# EAGLE board Maduino Zero 4G LTE A7670X v1.1 (EAGLE 6.1)
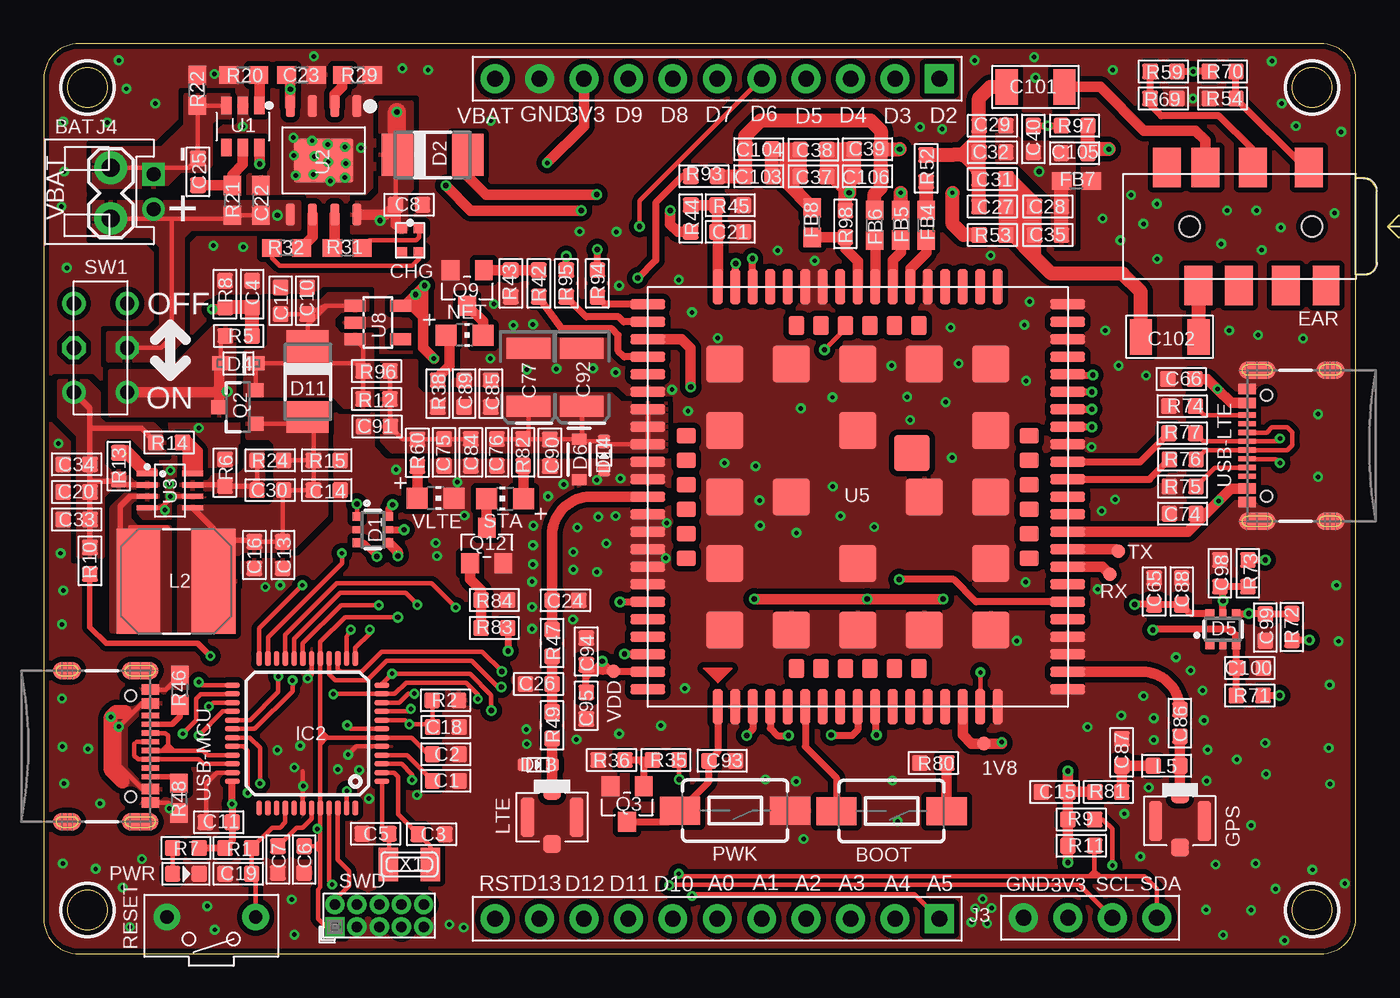
[diagram p2: board, top side]
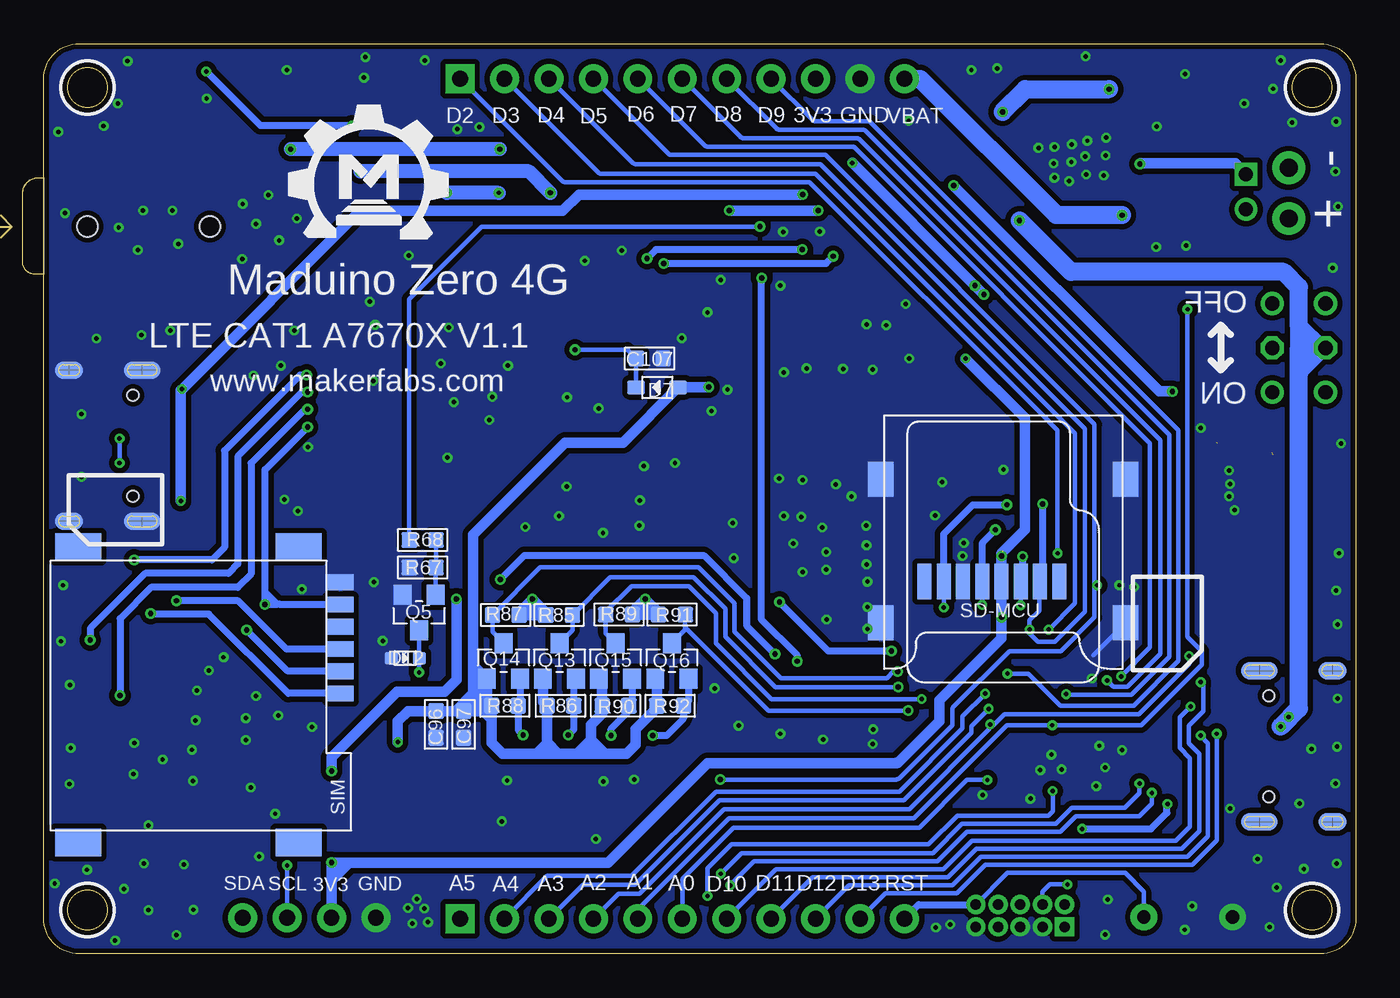
[diagram p3: board, bottom side, seen from below]

Size 75 x 52 mm. Coordinates in mm from the lower left corner, seen from the top.
Outline: 2,0 73,0 arc90 75,2 75,50 arc90 73,52 2,52 arc90 0,50 0,2 arc90 2,0
Outline: circle at 72.5,2.5 radius 1.14
Outline: circle at 72.5,49.5 radius 1.14
Outline: circle at 2.5,2.5 radius 1.14
Outline: circle at 2.5,49.5 radius 1.14
Copper layers (1*16): Top 0.035mm / dielectric 1.5mm / Bottom 0.035mm
Design rules: minimum track width 6mil, minimum drill 10mil, track to track 6mil, track to pad 6mil, pad to pad 6mil, via to via 6mil, smd to smd 0mil, copper to edge 10mil, drill to drill 10mil, minimum pad ring 10mil, minimum via ring 6mil, stop-mask expansion 2mil, vias tented up to drill 30mil, thermal gap 0mil
Net classes: 0 default: width 0.203 mm; 2 gnd: width 0.305 mm, drill 0.559 mm, clearance 0.254 mm; 3 usbvcc: width 0.508 mm, drill 0.61 mm, clearance 0.254 mm; 4 USBpair: width 0.254 mm, drill 0.406 mm, clearance 0.406 mm

## Footprints (pad centres in the part's own frame; a part is rotated, then mirrored left to right if it is on the bottom)
PH2.0-2P-90-DIP = drill 0.8 square: 1 0,1 | drill 0.8: 2 0,-1
TACTILE_SWITCH_SMD_6.0X3.5MM = smd 2.3 x 1.6: 1 -3.15,0; 2 3.15,0
0603 = smd 0.889 x 0.889: 1 -0.762,0; 2 0.762,0
0603' = smd 1.1 x 1: 1 -0.85,0; 2 0.85,0
EIA3528 = smd 1.2 x 2.5: A 1.65,0; C -1.65,0
DISCRETE_C1206 = smd 1.27 x 2.032: 1 -1.651,0; 2 1.651,0
SMD4-160L160W = smd 0.6 x 0.7: 1 -0.7,0.5; 2 0.7,0.5; 3 -0.7,-0.5; 4 0.7,-0.5
PINHEAD_2X05_127 = drill 0.6 pad 1.016 square: 1 -0.635,2.54 | drill 0.6 pad 1.016: 2 0.635,2.54; 3 -0.635,1.27; 4 0.635,1.27; 5 -0.635,0; 6 0.635,0; 7 -0.635,-1.27; 8 0.635,-1.27; 9 -0.635,-2.54; 10 0.635,-2.54
SOT363 = smd 0.5 x 0.5: 1 -0.75,-0.9; 3 0.75,-0.9; 4 0.75,0.9; 6 -0.75,0.9 | smd 0.4 x 0.5: 2 0,-0.9; 5 0,0.9
DO-214AC = smd 1.8 x 2.4: A 2.025,0; C -2.025,0
SOD-323F = smd 1 x 0.8: A -1,0; C 1,0
SOD-323 = smd 0.63 x 0.83: A 1.15,0; C -1.15,0
SOD323 = smd 1 x 0.8: + -1.2,0; - 1.2,0
DISCRETE_SOD523 = smd 0.762 x 0.7: + -0.8,0; - 0.8,0
AUDIO8P-SMD-3.5-14.5X6.1X4.0MM = smd 1.6 x 2.25: 1 3.9,-3.375; 2 7.1,-3.375; 3 9.8,-3.375; 4 10.2,3.375; 6 5.2,3.375; 7 7.9,3.375; 8 12,-3.375 | smd 1.5 x 2.25: 5 2.9,3.375 | hole 1.2: 3.7,0; 10.7,0
4P-U-FL = smd 1.016 x 1.016: D -1.524,0; GND3 1.524,0 | smd 2.286 x 0.762: GND1 0,1.397; GND2 0,-1.397
TQFP48-7X7 = smd 0.85 x 0.32: 1 -4.275,2.75; 2 -4.275,2.25; 3 -4.275,1.75; 4 -4.275,1.25; 5 -4.275,0.75; 6 -4.275,0.25; 7 -4.275,-0.25; 8 -4.275,-0.75; 9 -4.275,-1.25; 10 -4.275,-1.75; 11 -4.275,-2.25; 12 -4.275,-2.75; 25 4.275,-2.75; 26 4.275,-2.25; 27 4.275,-1.75; 28 4.275,-1.25; 29 4.275,-0.75; 30 4.275,-0.25; 31 4.275,0.25; 32 4.275,0.75; 33 4.275,1.25; 34 4.275,1.75; 35 4.275,2.25; 36 4.275,2.75 | smd 0.32 x 0.85: 13 -2.75,-4.275; 14 -2.25,-4.275; 15 -1.75,-4.275; 16 -1.25,-4.275; 17 -0.75,-4.275; 18 -0.25,-4.275; 19 0.25,-4.275; 20 0.75,-4.275; 21 1.25,-4.275; 22 1.75,-4.275; 23 2.25,-4.275; 24 2.75,-4.275; 37 2.75,4.275; 38 2.25,4.275; 39 1.75,4.275; 40 1.25,4.275; 41 0.75,4.275; 42 0.25,4.275; 43 -0.25,4.275; 44 -0.75,4.275; 45 -1.25,4.275; 46 -1.75,4.275; 47 -2.25,4.275; 48 -2.75,4.275
11P-2.54 = drill 0.889 pad 1.651 square: 1 0,12.7 | drill 0.889 pad 1.651: 2 0,10.16; 3 0,7.62; 4 0,5.08; 5 0,2.54; 6 0,0; 7 0,-2.54; 8 0,-5.08; 9 0,-7.62; 10 0,-10.16; 11 0,-12.7
4P-65/35ROUND = drill 0.889 pad 1.651: 1 0,3.81; 2 0,1.27; 3 0,-1.27; 4 0,-3.81
1X02_LOCK = drill 1.016 pad 1.88: 1 -0.178,0; 2 2.718,0
SRN6045 = smd 2.5 x 6: 1 -2.175,0; 2 2.125,0
L0603 = smd 0.889 x 0.889: 1 -0.762,0; 2 0.762,0
CHIP-LED0805 = smd 1.2 x 1.2: A 0,-1.05; C 0,1.05
LED-0603 = smd 0.889 x 0.889: + -0.762,0; - 0.762,0
SOT23-3 = smd 0.8 x 0.9: 1 -0.95,-1; 2 0.95,-1; 3 0,1.1
SOT23 = smd 1.016 x 1.143: 1 -0.95,-1.016; 2 0.95,-1.016; 3 0,1.016
R0603 = smd 0.889 x 0.889: 1 -0.762,0; 2 0.762,0
0603-NO = smd 1.1 x 1: 1 -0.85,0; 2 0.85,0
2P-7.62X3.56-90D = drill 0.762 pad 1.524: P$1 0,2.54; P$2 0,-2.54
8P-SMD = smd 0.8 x 2.008: 1 -3.198,0.254; 2 -2.098,0.254; 3 -0.998,0.254; 4 0.102,0.254; 5 1.202,0.254; 6 2.302,0.254; 7 3.402,0.254; 8 4.502,0.254 | smd 1.45 x 2: 9 -7.002,2.6; 10 7.002,2.6; 11 -7.002,-5.598; 12 7.002,-5.598
MICROSIM = smd 1.5 x 0.9: 1 -0.8,2.5; 2 -0.8,5.04; 3 -0.8,7.58; 5 -0.8,1.23; 6 -0.8,3.77; 7 -0.8,6.31 | smd 2.61 x 1.56: P$1 1.6,-0.8; P$2 14.2,-0.8; P$3 14.2,16.1; P$4 1.6,16.1
6P-2CH-2.54-7.6X3.0 = drill 0.813 pad 1.27: CH1A -1.524,2.54; CH1B -1.524,-2.54; CH2A 1.524,2.54; CH2B 1.524,-2.54 | drill 0.813 pad 1.27 octagon: COM1 -1.524,0; COM2 1.524,0
PAD.03X.03 = smd 0.762 x 0.762: P$1 0,0
SOT-23-6 = smd 1 x 0.6: 1 -1.2,0.95; 2 -1.2,0; 3 -1.2,-0.95; 4 1.2,-0.95; 5 1.2,0; 6 1.2,0.95
SOP8-1.27P = smd 1.27 x 0.51: 1 -3.1,1.905; 2 -3.1,0.635; 3 -3.1,-0.635; 4 -3.1,-1.905; 5 3.1,-1.905; 6 3.1,-0.635; 7 3.1,0.635; 8 3.1,1.905 | smd 2.5 x 3.4: 9 0,0
TSOT23-8 = smd 1.2 x 0.3: 1 -1.3,0.975; 2 -1.3,0.325; 3 -1.3,-0.325; 4 -1.3,-0.975; 5 1.3,-0.975; 6 1.3,-0.325; 7 1.3,0.325; 8 1.3,0.975
A7670G = smd 2 x 0.6: 1 -12,8; 2 -12,7; 3 -12,6; 4 -12,5; 5 -12,4; 6 -12,3; 7 -12,2; 8 -12,1; 9 -12,0; 10 -12,-1; 11 -12,-2; 12 -12,-3; 13 -12,-4; 14 -12,-5; 15 -12,-6; 16 -12,-7; 17 -12,-8; 35 12,-8; 36 12,-7; 37 12,-6; 38 12,-5; 39 12,-4; 40 12,-3; 41 12,-2; 42 12,-1; 43 12,0; 44 12,1; 45 12,2; 46 12,3; 47 12,4; 48 12,5; 49 12,6; 50 12,7; 51 12,8 | smd 0.6 x 2: 18 -8,-12; 19 -7,-12; 20 -6,-12; 21 -5,-12; 22 -4,-12; 23 -3,-12; 24 -2,-12; 25 -1,-12; 26 0,-12; 27 1,-12; 28 2,-12; 29 3,-12; 30 4,-12; 31 5,-12; 32 6,-12; 33 7,-12; 34 8,-12; 52 8,12; 53 7,12; 54 6,12; 55 5,12; 56 4,12; 57 3,12; 58 2,12; 59 1,12; 60 0,12; 61 -1,12; 62 -2,12; 63 -3,12; 64 -4,12; 65 -5,12; 66 -6,12; 67 -7,12; 68 -8,12; 89 -11,-12; 90 -10,-12; 91 -9,-12; 92 9,-12; 93 10,-12; 94 11,-12; 95 11,12; 96 10,12; 97 9,12; 98 -9,12; 99 -10,12; 100 -11,12 | smd 2.1 x 2.1: 69 -7.6,7.6; 70 -7.6,3.8; 71 -7.6,0; 72 -7.6,-3.8; 73 -7.6,-7.6; 74 -3.8,-7.6; 75 0,-7.6; 76 3.8,-7.6; 77 7.6,-7.6; 78 7.6,-3.8; 79 7.6,0; 80 7.6,3.8; 81 7.6,7.6; 82 3.8,7.6; 83 0,7.6; 84 -3.8,7.6; 85 -3.8,0; 86 0,-3.8; 87 3.8,0; 88 0,3.8 | smd 1.1 x 0.9: 101 -9.8,3.5; 102 -9.8,2.1; 103 -9.8,0.7; 104 -9.8,-0.7; 105 -9.8,-2.1; 106 -9.8,-3.5; 113 9.8,-3.5; 114 9.8,-2.1; 115 9.8,-0.7; 116 9.8,0.7; 117 9.8,2.1; 118 9.8,3.5 | smd 0.9 x 1.1: 107 -3.5,-9.8; 108 -2.1,-9.8; 109 -0.7,-9.8; 110 0.7,-9.8; 111 2.1,-9.8; 112 3.5,-9.8; 119 3.5,9.8; 120 2.1,9.8; 121 0.7,9.8; 122 -0.7,9.8; 123 -2.1,9.8; 124 -3.5,9.8 | smd 2.05 x 2.05: 125 2.5,-3.1
SOT23-5 = smd 0.69 x 1.2: 1 -0.95,-1.3; 2 0,-1.3; 3 0.95,-1.3; 4 0.95,1.3; 5 -0.95,1.3
USB-C-16P-5 = smd 0.3 x 1: A5 -1.25,-0.34; A6 -0.25,-0.34; A7 0.25,-0.34; A8 1.25,-0.34; B5 1.75,-0.34; B6 0.75,-0.34; B7 -0.75,-0.34; B8 -1.75,-0.34 | smd 0.6 x 1: GND -3.225,-0.34; GND2 3.225,-0.34; VBUS1 -2.45,-0.34; VBUS2 2.45,-0.34 | smd 1 x 2.1: SHLD1 -4.32,-0.915; SHLD2 4.32,-0.915 | smd 1 x 2.1 bottom: SHLD3 -4.32,-0.915; SHLD4 4.32,-0.915 | smd 1 x 1.6: SHLD5 -4.32,-5.095; SHLD8 4.32,-5.095 | smd 1 x 1.6 bottom: SHLD6 -4.32,-5.095; SHLD7 4.32,-5.095 | hole 0.65: -2.89,-1.445; 2.89,-1.445
XTAL3215 = smd 1.1 x 1.9: P$1 1.2,0; P$2 -1.2,0

## Placement (x,y rotation side)
BAT  PH2.0-2P-90-DIP  [PH2.0-2P-90-DIP]  6.27,43.54 0 top
BOOT  MOMENTARY-SWITCH-SPST-SMD-6.0X3.5MM  [TACTILE_SWITCH_SMD_6.0X3.5MM]  48.46,8.15 180 top
C1  1uF  [0603]  22.99,9.88 0 top
C2  100nF  [0603]  22.99,11.4 180 top
C3  22pF  [0603]  22.17,6.83 0 top
C4  0.1uF  [0603]  11.91,37.69 90 top
C5  22pF  [0603]  18.97,6.86 180 top
C6  100nF  [0603]  14.88,5.38 270 top
C7  1uF  [0603]  13.39,5.38 270 top
C8  0.1uF  [0603]  20.88,42.8 0 top
C10  4.7uF  [0603]  15.06,37.31 270 top
C11  4.7uF  [0603]  10.01,7.52 0 top
C13  10uF  [0603]  13.67,22.78 90 top
C14  1uF  [0603]  16.18,26.49 180 top
C15  100nF  [0603]  57.78,9.25 180 top
C16  1uF  [0603]  12.04,22.78 90 top
C17  10uF  [0603]  13.54,37.31 270 top
C18  0.1uF  [0603]  22.99,12.95 0 top
C19  0.1uF  [0603]  11.13,4.57 0 top
C20  10uF  [0603]  1.88,26.39 0 top
C21  1nF  [0603]  39.24,41.25 0 top
C22  10uF  [0603']  12.42,43.05 90 top
C23  1.0uF  [0603']  14.73,50.22 0 top
C24  NC  [0603]  29.82,20.19 180 top
C25  0.1uF  [0603]  8.81,44.68 270 top
C26  NC  [0603]  28.3,15.42 0 top
C27  33pF  [0603]  54.23,42.7 180 top
C28  33pF  [0603]  57.4,42.7 180 top
C29  33pF  [0603]  54.23,47.32 0 top
C30  33pF  [0603]  12.95,26.49 0 top
C31  100pF  [0603]  54.23,44.27 180 top
C32  100pF  [0603]  54.23,45.8 0 top
C33  1uF  [0603]  1.88,24.82 0 top
C34  0.1uF  [0603]  1.88,27.97 0 top
C35  100pF  [0603]  57.4,41.07 180 top
C37  33pF  [0603]  43.99,44.42 180 top
C38  100pF  [0603]  43.99,45.95 180 top
C39  10pF  [0603]  47.09,45.97 0 top
C40  10pF  [0603]  56.57,46.56 90 top
C65  33pF  [0603]  63.47,20.7 270 top
C66  10uF  [0603]  65.02,32.84 180 top
C74  0.1uF  [0603]  65.1,25.15 180 top
C75  10uF  [0603]  22.89,28.65 90 top
C76  1uF  [0603]  25.91,28.65 90 top
C77  100uF  [EIA3528]  27.71,32.94 270 top
C84  10uF  [0603]  24.41,28.65 90 top
C85  1uF  [0603]  25.55,32 270 top
C86  100pF  [0603]  64.95,13.18 90 top
C87  33pF  [0603]  61.62,11.51 90 top
C88  0.1uF  [0603]  65.05,20.7 270 top
C89  10pF  [0603]  24.03,32 270 top
C90  33pF  [0603]  28.93,28.63 90 top
C91  0.1uF  [0603]  19.05,30.12 0 top
C92  100uF  [EIA3528]  30.76,32.94 270 top
C93  NC  [0603]  38.79,11.02 180 top
C94  1uF  [0603]  31.01,17.27 270 top
C95  0.1uF  [0603]  31.01,14.17 90 top
C96  1uF  [0603]  52.58,13.11 90 bottom
C97  0.1uF  [0603]  51,13.11 90 bottom
C98  22pF_NC  [0603]  67.23,21.74 270 top
C99  22pF_NC  [0603]  69.82,18.64 90 top
C100  22pF_NC  [0603]  68.94,16.33 180 top
C101  47uF  [DISCRETE_C1206]  56.69,49.53 0 top
C102  47uF  [DISCRETE_C1206]  64.36,35.26 0 top
C103  33pF  [0603]  40.87,44.42 180 top
C104  100pF  [0603]  40.87,45.97 180 top
C105  33pF  [0603]  58.93,45.75 180 top
C106  100pF  [0603]  47.09,44.42 180 top
C107  33pF  [0603]  40.36,34.01 180 bottom
CHG  [SMD4-160L160W]  20.95,40.77 90 top
CN2  PINHEAD-2x5-P1.27  [PINHEAD_2X05_127]  19.18,2.18 90 top
D1  SMF05C  [SOT363]  18.82,24.23 270 top
D2  SS34  [DO-214AC]  22.23,45.64 0 top
D4  [SOD-323F]  11.13,33.73 0 top
D5  SMF05C  [SOT363]  67.41,18.54 0 top
D6  5.1V  [SOD-323]  30.61,28.24 270 top
D7  B5819WS  [SOD323]  39.93,32.36 180 bottom
D11  SS54  [DO-214AC]  15.09,32.69 270 top
D12  0603ESDA-05N  [DISCRETE_SOD523]  54.33,16.89 0 bottom
D13  0603ESDA-05N  [DISCRETE_SOD523]  28.27,10.79 0 top
D14  0603ESDA-05N  [DISCRETE_SOD523]  32.03,28.47 90 top
EAR  AUDIO-JACK-8P-SMD  [AUDIO8P-SMD-3.5-14.5X6.1X4.0MM]  76.2,41.55 180 top
FB4  120Ω  [0603']  50.44,41.63 90 top
FB5  120Ω  [0603']  49,41.63 270 top
FB6  120Ω  [0603']  47.5,41.63 90 top
FB7  120Ω  [0603']  59.03,44.17 0 top
FB8  120Ω  [0603']  43.92,41.78 90 top
GPS  [4P-U-FL]  64.95,7.59 270 top
IC2  SAMD21G18A-AUT  [TQFP48-7X7]  15.06,12.6 180 top
J2  [11P-2.54]  38.5,50 270 top
J3  [4P-65/35ROUND]  59.82,2.06 270 top
J4  [1X02_LOCK]  3.84,42.19 90 top
J8  [11P-2.54]  38.5,2 270 top
L2  10µH/±20%/3A  [SRN6045]  7.59,21.29 0 top
L5  68nH  [L0603]  64.19,10.74 0 top
LTE  [4P-U-FL]  29.06,7.8 270 top
NET  NET  [CHIP-LED0805]  24.05,35.36 270 top
PWK  MOMENTARY-SWITCH-SPST-SMD-6.0X3.5MM  [TACTILE_SWITCH_SMD_6.0X3.5MM]  39.52,8.18 180 top
PWR  RED  [LED-0603]  8.13,4.57 0 top
Q2  MOSFET-PCHANNEL  [SOT23-3]  11.13,31.24 90 top
Q3  2N7002  [SOT23]  33.35,8.56 180 top
Q5  2N7002  [SOT23]  53.54,19.51 180 bottom
Q9  BC847C  [SOT23]  24.21,38.05 180 top
Q12  BC847C  [SOT23]  25.32,23.32 0 top
Q13  2N7002  [SOT23]  45.52,16.74 0 bottom
Q14  2N7002  [SOT23]  48.72,16.74 0 bottom
Q15  2N7002  [SOT23]  42.32,16.74 0 bottom
Q16  2N7002  [SOT23]  39.09,16.74 0 bottom
R1  10k  [R0603]  11.13,6.05 180 top
R2  1M  [R0603]  22.96,14.48 180 top
R5  1M/1%  [R0603]  11.15,35.31 180 top
R6  33K  [R0603]  10.36,27.48 270 top
R7  1K  [R0603]  8.13,6.05 180 top
R8  1M/1%  [R0603]  10.36,37.69 270 top
R9  4.7K  [R0603]  59.31,7.67 180 top
R10  1M  [R0603]  2.64,22.45 90 top
R11  4.7K  [R0603]  59.31,6.17 180 top
R12  0R  [R0603]  19.02,31.7 180 top
R13  100K  [R0603]  4.29,27.86 270 top
R14  200K  [R0603]  7.16,29.21 180 top
R15  100k  [R0603]  16.18,28.19 0 top
R20  1K  [0603']  11.43,50.22 0 top
R21  100R  [0603']  10.79,43.05 90 top
R22  NC  [0603']  8.79,49.35 90 top
R24  200K  [R0603]  12.95,28.19 0 top
R29  1.2k  [0603']  17.93,50.22 180 top
R31  47R  [0603']  17.35,40.34 0 top
R32  47R  [0603']  13.89,40.34 180 top
R35  1K  [R0603]  35.56,11.07 0 top
R36  10K  [R0603]  32.46,11.07 0 top
R38  1.2K  [R0603]  22.53,32 270 top
R42  100R  [R0603]  28.3,38.3 270 top
R43  30K  [R0603]  26.7,38.3 90 top
R44  680K  [R0603]  36.98,42.01 270 top
R45  470K  [R0603]  39.24,42.77 180 top
R46  5.1K  [0603-NO]  7.8,15.06 90 top
R47  0R  [R0603]  29.06,17.75 270 top
R48  5.1K  [0603-NO]  7.72,8.89 270 top
R49  0R  [R0603]  29.06,13.06 270 top
R52  0R  [R0603]  50.44,44.88 270 top
R53  0R  [R0603]  54.23,41.07 180 top
R54  NC  [R0603]  67.39,48.87 180 top
R59  NC  [R0603]  64.01,50.42 180 top
R60  1K  [R0603]  21.36,28.63 90 top
R67  10K  [R0603]  53.34,22.07 0 bottom
R68  1K  [R0603]  53.34,23.65 180 bottom
R69  0R  [R0603]  64.01,48.87 0 top
R70  0R  [R0603]  67.39,50.42 0 top
R71  22R  [R0603]  68.94,14.76 180 top
R72  22R  [R0603]  71.35,18.67 90 top
R73  22R  [R0603]  68.83,21.74 270 top
R74  5.1K  [R0603]  65.07,31.29 0 top
R75  5.1K  [R0603]  65.1,26.7 0 top
R76  22R  [R0603]  65.1,28.24 0 top
R77  22R  [R0603]  65.07,29.74 0 top
R80  1K  [R0603]  50.85,10.9 180 top
R81  0R  [R0603]  60.86,9.25 180 top
R82  1.2K  [R0603]  27.41,28.65 90 top
R83  100R  [R0603]  25.76,18.62 0 top
R84  30K  [R0603]  25.76,20.22 180 top
R85  30K  [R0603]  45.54,19.35 180 bottom
R86  10K  [R0603]  45.47,14.17 180 bottom
R87  30K  [R0603]  48.59,19.35 0 bottom
R88  10K  [R0603]  48.64,14.17 180 bottom
R89  30K  [R0603]  42.11,19.38 0 bottom
R90  10K  [R0603]  42.32,14.17 180 bottom
R91  30K  [R0603]  39.09,19.38 180 bottom
R92  10K  [R0603]  39.19,14.17 180 bottom
R93  2.2K  [R0603]  37.74,44.42 0 top
R94  1K  [R0603]  31.65,38.3 90 top
R95  1K  [R0603]  29.87,38.3 90 top
R96  0R  [R0603]  19.02,33.3 180 top
R97  0R  [R0603]  58.93,47.32 0 top
R98  2.2K  [R0603]  45.82,41.71 90 top
RESET  [2P-7.62X3.56-90D]  9.58,2.11 270 top
SD-MCU  SD  [8P-SMD]  20.16,21.53 180 bottom
SIM  MICROSIM  [MICROSIM]  58.83,22.45 180 bottom
STA  NET  [CHIP-LED0805]  26.37,26.01 90 top
SW1  [6P-2CH-2.54-7.6X3.0]  3.25,34.62 180 top
TP1  TEST-POINT3  [PAD.03X.03]  32.56,16.13 0 top
TP2  TEST-POINT3  [PAD.03X.03]  61.42,22.99 0 top
TP3  TEST-POINT3  [PAD.03X.03]  60.93,21.69 0 top
TP6  TEST-POINT3  [PAD.03X.03]  53.75,12.01 0 top
U1  DW06D  [SOT-23-6]  11.38,47.27 270 top
U2  TP4056  [SOP8-1.27P]  16,45.34 270 top
U3  MP2143DJ-LF-Z  [TSOT23-8]  7.21,26.47 0 top
U5  A7670G  [A7670G]  46.53,26.11 90 top
U8  SPX3819  [SOT23-5]  19.1,36.07 270 top
U$1  [MAKERFABS_0.3]  60.54,40.89 0 bottom
USB-LTE  [USB-C-16P-5]  68.45,29.03 90 top
USB-MCU  [USB-C-16P-5]  6.43,11.86 270 top
VLTE  LED2  [CHIP-LED0805]  22.4,26.04 270 top
X1  32.768K  [XTAL3215]  20.9,5.11 0 top

## Tracks (layer width: path | path; a pad name or v marks a point on that pad's centre or on a via)
1.8V  (via drill 0.25, 0.3)
  Top 0.61: U5.97 36.47,35.11 36.98,34.59 v36.98,32.38 | U5.15 52.53,12.52 53.03,12.01 TP6.P$1 53.77,11.99 53.8,11.99 53.82,12.01 54.76,12.01 v54.76,12.09
  Bottom 0.254: 38.7,32.38 D7.+
  Bottom 0.406: 42.82,11.48 43.71,12.37 44.35,11.73 | 44.65,11.43 44.35,11.73 | 44.35,11.73 43.31,11.73 43.64,11.4 45.41,11.4 46.2,12.19 46.94,11.46 48.06,11.46
  Bottom 0.61: 43.61,11.43 41.68,11.43 41.17,11.94 41.17,12.83 39.95,14.05 R92.2 39.95,15.64 Q16.1 | 43.61,11.43 44.65,11.43 46.13,11.43 | 43.61,11.43 43.71,11.53 43.71,12.37 43.71,13.08 43.08,13.72 R90.2 43.08,15.54 Q15.1 | 46.13,11.43 46.23,11.53 R86.2 46.47,14.41 Q13.1 | R88.2 49.4,13.39 | 49.4,13.39 49.4,12.06 48.77,11.43 46.13,11.43 | 50.44,16.5 Q14.1 49.67,14.44 R88.2 | 50.44,16.5 50.44,23.95 45.19,29.21 41.88,29.21 D7.+ | 38.7,32.38 v36.98,32.38 | R88.2 49.71,13.87 C97.2 51.08,13.87 | 51.46,13.87 C96.2 54.18,13.87 54.76,13.28 v54.76,12.09 | 50.44,16.5 50.44,14.88 51.46,13.87 | 51.46,13.87 51.08,13.87 | 51.08,13.87 49.94,15.01 49.94,14.3 50.27,13.97 49.99,13.97 49.4,13.39
+3V3  (via drill 0.25, 0.3)  (1 unrouted)
  Top 0.254: 10.79,7.54 C11.2 | 15.81,12.32 IC2.17 15.81,17.82 17.22,19.23 v20.24,19.23 | 15.81,12.32 15.81,12.09 | 15.81,12.09 IC2.44 15.81,7.14 | 15.81,12.32 15.84,12.35 IC2.6 21.03,12.34 21.97,11.4 C2.2 | 15.81,7.14 15.81,6.17 | 15.81,6.17 15.81,3.8 15.67,3.66 15.67,2.01 16.14,1.54 CN2.1 | C6.1 15.52,6.15 | 15.54,6.15 15.79,6.15 15.81,6.17 | v15.65,7.14 15.81,7.14 | 10.77,9.8 10.77,9.83 IC2.36 | 15.82,12.75 16.23,12.34 16.15,12.34 15.82,12.01 15.82,12.08 15.81,12.09 | 15.52,6.15 15.54,6.15 | 15.54,6.15 15.8,6.4 | 15.52,6.15 15.8,5.87 | U8.5 20.61,37.02
  Top 0.406: R7.1 R1.2 10.77,6.45 C11.2 | 10.79,7.54 10.79,8.54 v10.77,8.56 10.77,9.8
  Top 0.61: D1.4 20.17,23.03 arc-45 20.24,22.85 v20.24,22.73 | v58.55,5.21 R11.2 R9.2 C15.1 | C15.1 v58.55,10.44 | C15.1 R81.2 | v40.62,20.27 v47.07,20.27 v51.41,20.27 | v22.3,34.01 21.69,34.62 21.69,36.4 | 21.69,36.4 21.69,37.01 | 21.69,37.01 21.69,38.1 v21.77,38.18 20.57,36.98 21.11,36.98 21.69,36.4 | J2.9 30.88,47.29 v28.78,45.19 | 20.61,37.02 21.68,37.02 21.69,37.01 | 21.69,37.01 21.69,37.11 21.39,37.41
  Bottom 0.254: 20.24,21.26 SD-MCU.4
  Bottom 0.406: v15.65,7.14 11.7,7.14 10.79,8.05 10.79,8.54 v10.77,8.56
  Bottom 0.61: 20.24,21.26 v20.24,19.23 20.24,18.03 23.8,14.48 23.8,13.28 26.11,10.97 arc45 26.29,10.9 37.05,10.9 42.74,5.21 57.53,5.21 | SD-MCU.4 20.26,22.79 arc45 20.18,22.97 18.92,24.23 18.92,30.63 v22.3,34.01 | R91.2 40.69,19.38 | 40.69,19.38 R89.2 | v40.62,20.27 40.62,19.46 40.69,19.38 | R85.2 47.12,19.36 | 47.12,19.36 R87.2 | v47.07,20.27 47.07,19.41 47.12,19.36 | v40.62,20.27 39.83,19.48 41.35,19.48 41.35,19.53 v40.62,20.27 | v47.07,20.27 46.18,19.38 47.95,19.38 v47.07,20.27 | v51.41,20.27 51.41,15.65 52.09,14.96 54.81,14.96 58.55,11.23 v58.55,10.44 | J3.3 58.55,4.19 | 58.55,4.19 v58.55,5.21 57.53,5.21 | 57.53,5.21 58.55,4.19 | v28.78,45.19 v21.77,38.18 v21.26,37.67
A0  (via drill 0.25)
  Top 0.254: IC2.3 20.45,10.85 21.06,10.24 v21.06,9.93
  Bottom 0.254: J8.6 38.5,4.3 35.59,7.21 24.94,7.21 22.23,9.93 v21.06,9.93
A1  (via drill 0.25)
  Top 0.254: IC2.7 17.55,12.85 v17.35,13.06 | 10.26,36.83 R8.2
  Top 0.61: 10.26,36.83 v9.63,36.83
  Top 0.813: R5.1 C4.1 R8.2
  Bottom 0.254: J8.5 41.04,2.55 35.84,7.75 25.25,7.75 19.94,13.06 v17.35,13.06 12.27,13.06 8.81,16.51 8.81,17.3 9.63,18.11 v9.63,36.83
A2  (via drill 0.25)
  Top 0.254: R2.2 22.23,14.45 C18.1 22.07,13.11 v20.9,13.11 20.66,13.35 IC2.8
  Top 0.305: R10.1 2.64,18.67 3.58,17.73 8.81,17.73 v9.53,17.02
  Bottom 0.254: J8.4 42.15,3.43 40.95,3.43 36.12,8.26 25.53,8.26 20.93,12.85 | 20.93,12.85 20.8,12.98 | 20.8,12.98 20.09,13.69 12.39,13.69 9.53,16.56 v9.53,17.02 | 20.93,12.88 20.93,12.85 | v20.9,13.11 20.9,13.08 20.8,12.98
A3  (via drill 0.25)
  Top 0.254: IC2.9 20.83,13.85 v20.98,13.99
  Bottom 0.254: J8.3 44.18,3.94 41.2,3.94 36.37,8.76 25.83,8.76 21.97,12.62 21.97,13.01 v20.98,13.99
A4  (via drill 0.25)
  Top 0.254: IC2.10 20.32,14.35 20.83,14.86 v21.18,14.86
  Bottom 0.254: J8.2 46.22,4.45 41.4,4.45 36.58,9.27 26.09,9.27 22.48,12.88 22.48,13.56 v21.18,14.86
A5  (via drill 0.25)
  Top 0.254: J8.1 51.19,2 49.78,3.4 37.16,3.4 v37.06,3.3 | IC2.47 17.32,8.33 v17.32,9.3
  Bottom 0.254: v37.06,3.3 37.06,4.88 35.69,6.25 24.43,6.25 22.78,7.9 17.58,7.9 17.32,8.15 v17.32,9.3
AGND  (via drill 0.3)
  Top 0.203: C38.1 44.78,45.97
  Top 0.813: C35.1 C28.1 58.17,44.16 FB7.1 | R98.2 45.82,44.58 | 45.82,44.58 45.82,45.97 | 45.67,44.42 C37.1 44.78,44.45 44.78,44.76 | 45.67,44.42 45.82,44.58 | 44.78,45.97 44.78,45.24 44.78,44.76 | 45.67,44.42 45.06,45.03 45.06,45.97 C39.1 C106.2 46.05,44.15 v46.05,43.48 44.78,44.76
  Bottom 0.813: v46.05,43.48 47.27,44.7 v56.9,44.7
  pour Top: 57.68,40.56 57.68,43.26 55.88,45.06 55.75,45.19 54.51,45.19 54.51,47.73 55.6,47.73 55.6,46.69 55.96,46.33 58.72,46.33 58.85,46.33 58.85,40.69 58.85,40.56
ANT
  Top 0.61: U5.60 31.27,26.11 arc90 29.06,23.9 C24.2 R47.1
AREFA
  Top 0.254: IC2.4 20.76,11.35 C1.1
BOOT
  Top 0.406: U5.6 43.53,11.84 45.31,10.06 BOOT.2
D0  (via drill 0.3)
  Top 0.254: IC2.16 16.31,15.97 16.66,15.62 18.49,15.62 19.61,16.74 24.46,16.74 25.96,15.24 v26.16,15.24
  Bottom 0.254: v26.16,15.24 33.17,15.24 36.04,18.11 36.04,19.71 37.85,21.51 42.62,21.51 R85.1 44.78,18.49 Q13.3
D1  (via drill 0.3)
  Top 0.254: IC2.15 16.81,16.26 16.97,16.1 18.16,16.1 19.3,17.25 25.07,17.25 v26.19,16.13
  Bottom 0.254: v26.19,16.13 26.42,16.13 26.8,15.75 32.87,15.75 35.51,18.39 35.51,20.02 37.57,22.07 46.63,22.07 R87.1 49.35,18.39 Q14.3
D2  (via drill 0.25)
  Top 0.254: IC2.23 12.83,16.89 12.83,18.09 17.04,22.3 v17.04,22.89
  Bottom 0.254: J2.1 45.37,44.17 arc-45 45.19,44.09 31.22,44.09 18.03,30.91 17.04,29.92 v17.04,22.89
D3  (via drill 0.25)
  Top 0.254: IC2.14 17.31,18.12 v17.55,18.52
  Bottom 0.254: J2.2 43.31,44.65 arc-45 43.13,44.58 30.89,44.58 16.05,29.74 16.05,20.02 v17.55,18.52
D4  (via drill 0.25, 0.3)
  Top 0.254: D1.1 v17.92,25.69 v17.91,25.7 | IC2.13 17.81,17.48 18.64,18.31 v18.64,18.52
  Bottom 0.254: 17.91,21.42 SD-MCU.2 18.09,21.24 18.09,19.61 18.64,19.05 v18.64,18.52 18.64,18.31 18.16,17.83 17.2,17.83 15.49,19.53 15.49,30 30.61,45.11 41.12,45.11 arc45 41.3,45.19 J2.3
  Bottom 0.406: v17.91,25.7 17.91,21.42
D5  (via drill 0.25, 0.3)
  Top 0.254: R35.2 v36.32,9.96 | IC2.24 12.31,18.59 v14.78,21.06
  Bottom 0.254: J2.4 39.3,45.72 arc-45 39.12,45.64 30.33,45.64 14.94,30.25 14.94,21.03 | v36.32,9.96 26.27,9.96 arc-45 26.09,10.03 23.06,13.06 23.06,13.94 arc45 22.99,14.12 19.81,17.3 16.87,17.3 14.94,19.23 14.94,21.03 | v14.78,21.06 14.91,21.06 14.94,21.03
D6  (via drill 0.25, 0.3)
  Top 0.254: IC2.29 11.8,13.35 13.41,14.96 v13.41,15.85 | v34.06,41.55 34.06,43.02 J2.5
  Bottom 0.254: v13.41,15.85 11.76,17.5 11.76,29.18 28.63,46.05 arc-45 28.81,46.13 37.06,46.13 arc45 37.24,46.2 J2.5 | v34.06,41.55 49.96,41.55 54.1,37.41 R68.2
D7  (via drill 0.25)
  Top 0.254: IC2.30 12.06,12.85 14.22,15.01 v14.22,15.62
  Bottom 0.254: v14.22,15.62 13.87,15.27 13.06,15.27 11.18,17.14 11.18,29.34 28.37,46.53 arc-45 28.55,46.61 35,46.61 arc45 35.18,46.68 J2.6
D8  (via drill 0.25)
  Top 0.254: v16.56,14.83 16.58,14.85 IC2.11 20.07,14.86 20.7,15.49 24.13,15.49 24.82,14.81 v24.82,14.55
  Bottom 0.254: v16.56,14.83 16.54,14.81 12.83,14.81 10.67,16.97 10.67,29.67 28.02,47.02 arc-45 28.2,47.09 32.95,47.09 arc45 33.13,47.17 J2.7 | v24.82,14.55 33.4,14.55 36.58,17.73 36.58,19.46 38.12,21.01 41.4,21.01 42.88,19.53 R89.1 42.88,18.31 Q15.3
D9  (via drill 0.25, 0.3)
  Top 0.254: IC2.12 19.34,15.43 v19.91,16 24.36,16 25.58,14.78 v25.58,13.89
  Bottom 0.254: v19.91,16 18.72,16 16.89,14.17 12.7,14.17 10.13,16.74 10.13,29.92 27.71,47.5 arc-45 27.89,47.57 30.89,47.57 arc45 31.07,47.65 J2.8 | v25.58,13.89 33.58,13.89 38.33,18.64 R91.1 38.33,18.52 Q16.3
D10  (via drill 0.25)
  Top 0.254: IC2.27 9.68,14.35 v9.45,14.12
  Bottom 0.254: J8.7 33.13,4.83 23.57,4.83 21.95,6.45 10.29,6.45 9.47,7.26 9.47,11.18 10.06,11.76 10.06,13.51 v9.45,14.12
D11  (via drill 0.25)
  Top 0.254: IC2.25 9.04,15.35 v8.87,15.52
  Bottom 0.254: J8.8 31.05,4.37 23.32,4.37 21.69,5.99 9.96,5.99 8.94,7.01 8.94,11.43 9.55,12.04 9.55,13.03 8.71,13.87 8.71,15.37 v8.87,15.52
D12  (via drill 0.25)
  Top 0.254: IC2.28 10.24,13.85 v8.87,12.47
  Bottom 0.254: J8.9 28.97,3.91 23.06,3.91 21.44,5.54 9.63,5.54 8.46,6.71 8.46,12.04 8.87,12.45 v8.87,12.47
D13  (via drill 0.25)
  Top 0.254: IC2.26 10.77,14.83 8.97,14.83 8.71,14.58 8.71,13.34 v7.95,12.57
  Bottom 0.254: J8.10 26.89,3.45 22.81,3.45 21.18,5.08 9.35,5.08 7.95,6.48 v7.95,12.57
D+
  Top 0.254: IC2.34 9.12,10.85 8.85,11.11 USB-MCU.B6 5.4,11.11 5.18,11.33 5.18,11.99 5.31,12.12 USB-MCU.A6
D-
  Top 0.254: IC2.33 9.38,11.35 9.12,11.61 7.11,11.61 | USB-MCU.A7 7.11,11.61 | USB-MCU.B7 6.95,12.61 7.11,12.45 7.11,11.94 | 7.11,11.94 7.11,11.61 | 7.11,11.94 6.81,11.63 7.39,11.63 7.14,11.89
DONE
  Top 0.61: U2.6 15.37,40.96 R32.1
EAR_N
  Top 0.61: U5.41 48.53,39.62 49,40.08 FB5.2
EAR_P
  Top 0.61: U5.40 49.53,39.14 50.44,40.06 FB4.1
GND  (via drill 0.25)
  Top 0.254: IC2.35 9.89,10.35 9.3,9.75 9.3,7.57 C11.1 | IC2.42 14.81,10.44 | IC2.5 17.87,11.85 v17.4,11.38 | USB-MCU.GND2 7.12,8.64 R48.2 | USB-MCU.GND 6.97,15.09 R46.2 | IC2.18 15.31,15.95 v15.09,15.72 | U3.4 6.72,25.49 7.37,26.14 U3.6
  Bottom 0.254: 15.01,17.07 SD-MCU.9
  other vias: 14.83,9.58 21.34,9.07 24,1.5 13.36,11.63 14.17,3.1 14.66,11.89 5.61,5.41 1.04,18.82 9.78,1.37 2.97,4.85 73.79,42.32 18.59,8.86 71.58,47.29 27.97,35.97 60.48,25.3 69.82,12.04 69.62,40.21 27.58,12.83 70.76,48.59 38.53,35.18 40.92,25.91 62.15,43.36 61.54,40.77 68.2,11.1 51.84,35.79 6.93,25.35 17.27,45.16 25.55,47.6 1.07,11.84 22.48,22.73 44.07,39.6 69.32,42.47 53.67,3.12 14.33,10.64 22.4,23.47 1.12,20.75 1.04,14.58 15.42,44.53 7.24,27.61 17.22,46.1 7.24,26.14 21.97,50.5 27.99,24.46 20.5,50.6 15.47,45.57 15.34,46.46 2.54,11.71 16.23,46.25 14.4,44.48 36.3,38.51 29.31,33.43 35.28,13.03 16.26,45.24 53.21,51.05 18.14,46.05 60.25,20.83 69.88,10.26 49.35,31.83 0.84,29.16 70.21,51 74.17,46.96 41.96,40.18 60.53,42.01 63.63,42.85 61.11,50.5 56.06,35.94 67.77,35.61 72.85,27.25 72.85,30.84 67.64,42.47 67.31,40.56 51.36,47.12 28.83,26.14 69.01,2.49 66.45,2.51 70.92,0.76 70.41,3.71 74.37,4.01 30.63,41.27 55.63,17.88 12.67,20.95 27.91,19.81 45.54,25.02 17.22,44.35 0.97,22.89 1.09,5.16 4.52,3.78 4.93,1.52 16.81,10.54 9.35,2.72 14.33,1.09 23.19,1.68 32.97,27.15 56.16,32.74 72.52,4.8 71.98,35.15 65.68,48.87 70.71,41.5 53.92,1.73 53.04,1.8 54.18,2.62 53.24,2.59 8.86,30.05 18.03,10.49 7.19,26.85 60.68,35.61 62.87,41.71 67.41,1.07 27.91,18.57 63.65,39.7 45.09,31.8 69.42,35.36 45.11,26.7 47.47,24.38 40.94,24.46 40.69,27.86 38.91,28.04 43.28,31.17 51.56,31.52 51.92,28.35 48.46,33.6 52.3,33.73 49.53,30.51 37.06,36.65 56.36,37.26 43.03,24.05 32.89,12.57 36.65,15.16 31.7,24.97 30.28,22.96 30.51,24.36 30.45,12.24 27.61,11.99 1.17,9.73 3.23,8.59 7.19,8.31 14.27,46.63 32.89,38.18 14.3,45.62 9.75,50.27 30.28,21.95 20.14,27.66 35.92,32.23 36.83,31.01 27.97,23.34 16.38,44.15 73.51,15.37 73.53,9.7 73.46,11.76 73.89,21.06 74.02,17.86 64.72,16.94 65.56,16.18 66.24,15.04 66.32,13.34 66.52,11.66 66.47,9.88 63.45,12.22 63.45,13.46 62.87,14.73 59.66,12.95 61.59,13.61 63.17,9.5 61.77,8 62.69,5.56 66.98,5.11 69.01,7.34 69.27,5.16 56.13,21.23 63.02,33.05 61.24,25.96 59.89,28.96 61.44,33.6 54.13,39.9 56.69,50.06 56.62,51.23 50.09,47.24 32.74,41.25 41.25,9.96 43,9.86 48.51,9.91 48.82,7.57 43.43,6.55 4.29,51.05 4.72,49.43 3.63,47.5 1.12,47.55 1.17,44.7 1.02,42.7 6.38,48.59 11.38,47.27 15.44,51.28 1.32,39.19 11.4,40.39 9.7,40.46 13.51,21.06 23.65,26.95 24.05,25.04 27.97,22.25 27.91,21.26 29.72,26.82 31.62,27.08 32.69,25.02 32.16,23.44 31.62,21.82 30.25,19.1 35.61,24.61 35.56,22.61 26.85,35.92 27.61,33.38 25.53,34.01 31.39,33.45 32.69,33.22 25.73,37.13
  pour Bottom (isolate 0.305, rank 6): -1.27,-1.27 110,-1.27 110,80 -1.27,80
  pour Top (isolate 0.305, rank 6): -2.54,-1.27 110,-1.27 110,80 -2.54,80
GNSS_PWR_EN  (via drill 0.3)
  Top 0.406: U5.98 v33.21,17.11 v33.2,17.12 | U5.20 53.3,20.11 52.02,21.39 v48.9,21.39
  Bottom 0.406: v48.9,21.39 47.52,22.76 37.26,22.76 34.82,20.32 34.82,18.75 v33.2,17.12
ISET
  Top 0.61: U2.2 16.64,49.12 17.07,49.55 17.07,50.2 R29.2
LTE_DTR  (via drill 0.3)
  Top 0.406: U5.3 40.53,12.82 v40.18,12.47
  Bottom 0.406: Q16.2 38.14,14.46 R92.1 38.43,13.44 39.4,12.47 v40.18,12.47
LTE_RI  (via drill 0.3)
  Top 0.406: U5.4 41.53,12.87 41.94,12.47 v42.57,12.47
  Bottom 0.406: Q15.2 41.37,14.36 | 41.37,14.36 R90.1 | v42.57,12.47 42.57,12.85 41.37,14.06 41.37,14.36
LTE_RXD  (via drill 0.3)
  Top 0.406: U5.10 47.53,12.56 v47.6,12.5
  Bottom 0.406: Q14.2 47.77,14.29 R88.1 47.88,12.78 v47.6,12.5
LTE_TXD  (via drill 0.3)
  Top 0.406: U5.9 46.53,12.8 46.2,12.47 45.03,12.47 v45.01,12.5
  Bottom 0.406: Q13.2 44.7,15.59 R86.1 44.7,12.8 v45.01,12.5
MF_GNSS_RXD  (via drill 0.3)
  Top 0.254: 40.51,38.13 U5.49
  Top 0.406: R94.2 v31.65,40.23 | 40.51,38.13 v40.51,39.73
  Bottom 0.406: v31.65,40.23 40.01,40.23 v40.51,39.73
MF_GNSS_TXD  (via drill 0.3)
  Top 0.406: R95.2 v29.87,39.85 | U5.50 39.53,39.43 v39.55,39.45
  Bottom 0.406: v39.55,39.45 30.28,39.45 v29.87,39.85
MIC_N
  Top 0.61: U5.43 46.53,39.57 45.82,40.28 R98.1 43.93,40.95 FB8.1
MIC_P
  Top 0.61: U5.42 47.53,40.75 FB6.1
MISO  (via drill 0.25, 0.3)
  Top 0.254: 19.74,25 D1.6 | v23.55,19.79 22.17,21.16 16.74,21.16 13.81,18.23 IC2.21
  Top 0.406: 19.74,25 19.74,25.45 v19.94,25.65
  Bottom 0.254: v23.55,19.79 23.55,21.26 SD-MCU.7
  Bottom 0.406: SD-MCU.7 23.56,23.99 21.89,25.65 v19.94,25.65
MOSI  (via drill 0.25, 0.3)
  Top 0.254: v19.15,19.91 16.99,19.91 14.81,17.73 IC2.19
  Top 0.406: D1.3 18.28,23.48 v19.05,22.71
  Bottom 0.254: v19.15,19.91 SD-MCU.3 19.12,21.3 arc-45 19.05,21.48
  Bottom 0.406: v19.05,22.71 19.05,21.48
N$3
  Top 0.254: PWR.+ R7.2
N$8
  Top 0.254: 4.95,24.38 7.09,24.38
  Top 0.305: U3.3 4.93,26.14 4.37,25.58 4.37,22.34 L2.1
  pour Top: 7.19,18.41 3.89,18.41 3.89,25.48 4.65,26.24 6.5,26.24 6.5,25.98 5.16,25.98 4.88,25.7 4.88,24.82 5.31,24.38 7.19,24.38
N$9
  Top 0.61: U1.5 11.38,45.11 10.79,44.53 R21.2 10.78,43.92 C25.2
N$10
  Top 0.61: U1.1 12.33,50.17 R20.2
N$11
  Top 0.254: CHG.3 21.45,39.72 21.06,39.32 13.49,39.32 13.06,39.75 13.06,40.32 R32.2
N$12
  Top 0.61: U2.7 16.64,40.47 R31.1
N$13  (1 unrouted)
  Top 0.254: U3.1 5.91,27.49 4.78,28.63 R13.1 | 4.22,28.93 4.8,28.93 6.1,27.64 6.4,27.64 6.4,27.43 5.46,27.43 5.46,27.58 4.6,28.45 4.6,28.68 4.72,28.8 4.72,28.52 5.61,27.64
N$16
  Top 0.254: C30.1 12.19,27 R24.1
  Top 0.305: U3.7 10.29,26.79 R6.2 11.91,26.72 12.19,27
  pour Top: 7.9,26.95 9.4,26.95 9.78,27.33 11.18,27.33 11.53,27.69 11.53,28.75 12.55,28.75 12.55,26.19 10.01,26.19 9.65,26.54 7.9,26.54
N$17  (1 unrouted)
  Top 0.254: U3.8 8.51,28.62 R14.1 | 7.8,29.21 8.05,28.96 8.05,27.43 8.97,27.43 8.97,28.78 8.23,29.52 8.23,29.21 8.74,28.7 8.74,27.61 8.28,27.61 8.28,28.7 8.23,28.75 8.23,28.98 7.98,29.23
N$18
  Top 0.254: R31.2 18.63,40.77 21.29,40.77 21.45,40.94 CHG.4
N$22
  Top 0.61: Q9.1 R43.2 R42.1
N$23
  Top 0.61: R38.1 22.53,32.94 23.19,33.6 23.19,35.13 23,35.31 NET.A
N$25
  Top 0.305: USB-MCU.A5 7.35,13.11 7.8,13.56 R46.1
N$26
  Top 0.305: USB-MCU.B5 7.35,10.11 R48.1
N$27
  Top 0.61: NET.C 25.1,36.14 Q9.3
N$28
  Top 0.61: R47.2 C26.2 R49.1
N$29
  Top 0.61: LTE.D 29.06,10.78 arc-90 D13.- R49.2 arc90 R49.2
N$31
  Top 0.813: FB4.2 R52.2
N$32
  Top 0.61: EAR.3 66.4,46.48 65.84,47.04 62.89,47.04 60.4,49.53 C101.2
N$33
  Top 0.813: C102.1 62.71,37.82 61.67,38.86 57.61,38.86 56.64,39.83 | 56.64,39.83 C35.2 C28.2 C27.1 | R53.1 C27.1 | C27.1 54.99,43.38 | 54.99,43.38 C31.1 | 56.64,39.83 55.4,41.07 55.4,42.16 55.42,42.19 55.98,42.19 55.98,40.87 | 55.19,44.3 56.64,42.85 56.64,42.77 56.03,43.38 54.99,43.38 | 54.99,43.38 55.75,42.62 55.75,42.14
N$34  (via drill 0.25)
  Top 0.406: C40.2 v57.38,47.32 R97.1 | R59.1 v65.71,50.42 R70.1
  Bottom 0.406: v57.38,47.32 62.61,47.32 v65.71,50.42
N$35  (via drill 0.3)
  Top 0.813: R93.2 C103.2 C104.2 40.11,46.74 41,47.62 47.27,47.62 47.85,47.04 C39.2 | FB6.2 47.5,43.41 47.85,43.76 C106.1 C39.2 | C39.2 v48.92,45.97 | C105.1 59.69,46.28 | 59.69,46.28 R97.2 | v60.88,45.97 59.99,45.97 59.69,46.28
  Bottom 0.813: v48.92,45.97 v60.88,45.97
N$36
  Top 0.406: EAR.2 69.1,45.96 67.18,47.88 63.88,47.88 63.25,48.51 R69.1 R59.2
N$37
  Top 0.406: EAR.1 72.09,44.93 R54.1 R70.2
N$38  (via drill 0.25)
  Top 0.813: FB5.1 v49,43.48 | R53.2 52.58,41.07 51.94,41.71 v51.94,43.48
  Bottom 0.813: v49,43.48 v51.94,43.48
N$39  (via drill 0.3)
  Top 0.254: U5.31
  Top 0.406: R71.1 v70.64,14.76 | U5.31 v59.92,31.11
  Bottom 0.406: v70.64,14.76 70.64,19.15 68.86,20.93 63.91,20.93 63.14,21.69 63.14,28.04 60.07,31.11 v59.92,31.11
N$43
  Top 0.406: R36.2 34.04,11.07 | 34.04,11.07 R35.1 | Q3.1 34.3,10.81 34.04,11.07
N$44  (via drill 0.3)
  Top 0.254: 71.37,17.93 R72.1
  Top 0.406: 71.37,17.93 v72.34,17.93 | U5.32 v59.91,32.11 v59.92,32.11
  Bottom 0.406: v59.92,32.11 60.22,32.11 63.91,28.42 63.91,22.28 64.44,21.74 69.19,21.74 72.34,18.59 v72.34,17.93
N$45  (via drill 0.3)
  Top 0.254: 58.57,33.07 U5.33
  Top 0.406: R73.1 v69.83,22.5 | 58.57,33.07 v59.97,33.07
  Bottom 0.406: v59.97,33.07 60.35,33.07 64.67,28.75 64.67,23.22 65.38,22.5 v69.83,22.5
N$46
  Top 0.61: R60.1 21.36,26.04 VLTE.A
N$47
  Top 0.254: USB-LTE.A5 66.95,27.78 R75.2
N$53
  Top 0.254: USB-LTE.B5 66.35,30.78 R74.2
N$55
  Top 0.203: USB-LTE.A6
  Top 0.254: R76.2 66.4,28.78 USB-LTE.A6 71.09,28.78 71.37,29.06 71.37,29.79 71.09,30.07 70.21,30.07 69.9,29.77 68.81,29.77 USB-LTE.B6
N$56  (via drill 0.25)
  Top 0.203: 68.81,28.27 USB-LTE.B7
  Top 0.254: R77.2 66.3,29.28 USB-LTE.A7 70.51,29.28 v70.66,29.44 | 68.81,28.27 70.43,28.27 v70.66,28.04
  Bottom 0.254: v70.66,28.04 v70.66,29.44
N$61
  Top 0.61: BOOT.1 R80.1
N$62
  Top 0.61: R81.1 C87.1 L5.1
N$65
  Top 0.61: GPS.D L5.2 C86.1
N$66
  Top 0.61: U5.90 62.78,16.11 arc-90 C86.2
N$67
  Top 0.61: R83.1 R84.2 24.99,20.78 24.38,21.39 24.38,22.29 Q12.1
N$68
  Top 0.61: STA.A R82.1
N$70
  Bottom 0.254: Q5.1 52.59,22.06 R67.2 R68.1
N$71
  Top 0.61: STA.C 25.32,24.34 Q12.3
N$77
  Top 0.813: C27.2 C31.2 53.47,44.78 | 53.47,44.78 C32.1 53.47,46.61 | 53.47,46.61 C29.1 53.47,48.9 54.1,49.53 C101.1 | R52.1 51.97,45.64 52.5,45.64 | 52.5,45.64 52.6,45.64 53.47,44.78 | 53.47,46.61 52.5,45.64
N$78
  Top 0.813: EAR.4 C102.2
N$79
  Top 0.406: U5.95 32.08,37.11 R94.1
N$80
  Top 0.406: U5.96 33.16,36.11 32.87,36.4 31.01,36.4 R95.1
N$81
  Top 0.203: C104.1 41.66,45.95
  Top 0.813: FB8.2 42.44,44.11 42.44,45.95 | C103.1 C104.1 | 41.66,45.95 42.44,45.95 | C37.2 C38.2 42.44,45.95
N$82  (via drill 0.3)
  Top 0.254: U5.116 45.83,35.72 v44.63,34.52
  Bottom 0.254: D7.- C107.2 41.63,34.52 v44.63,34.52
NETLED
  Top 0.406: U5.52 33.17,34.11 32.84,34.44 32.84,35.36 32.49,35.71 29.62,35.71 R42.2
NRST  (via drill 0.25)
  Top 0.254: U5.16 53.53,16.07 v53.54,16.08
  Bottom 0.254: Q5.3 53.54,16.9 D12.- 53.54,16.88 v53.54,16.08
PA00_XIN32
  Top 0.254: IC2.1 19.34,7.26 C5.1 19.74,5.14 X1.P$2
PA01_XOUT32
  Top 0.254: IC2.2 20.03,10.35 20.27,10.11 20.27,7.98 C3.1 22.1,6.14 X1.P$1
PWRKEY
  Top 0.406: U5.1 38.53,11.53 C93.2 38.02,9.83 PWK.2 35.74,7.54 Q3.3
RESET
  Top 0.254: RESET.P$1 12.12,4.34 C19.2 R1.1 13.06,7.21 13.51,7.21 13.81,7.51 IC2.40
  Bottom 0.254: CN2.10 19.91,4.62 13.18,4.62 12.12,3.56 RESET.P$1
  Bottom 0.406: J8.11 24.99,2.81 CN2.10
SCK  (via drill 0.25, 0.3)
  Top 0.254: v21.36,19.94 20.68,20.62 16.94,20.62 14.31,18 IC2.20
  Top 0.406: D1.5 v20.6,24.23
  Bottom 0.254: SD-MCU.5 v21.36,19.94
  Bottom 0.406: SD-MCU.5 21.36,23.37 arc45 21.28,23.55 v20.6,24.23
SCL  (via drill 0.25)
  Top 0.254: IC2.32 11.42,11.85 11.66,11.61 v11.66,9.2 | J3.2 59.21,3.94 35.79,3.94 v35.76,3.91 | R9.1 60.55,7.67 61.09,7.14 v61.09,5.05
  Bottom 0.254: v11.66,9.2 11.66,8.56 12.37,7.85 16,7.85 16.89,6.96 22.23,6.96 23.9,5.28 34.39,5.28 v35.76,3.91 | v61.09,5.05 J3.2
SDA  (via drill 0.25)
  Top 0.254: 59.77,4.42 36.45,4.42 v36.3,4.57 | 59.77,4.42 60.07,4.42 | 60.07,4.42 60.38,4.42 | 60.38,4.42 62.92,4.42 63.63,3.71 J3.1 | IC2.31 11.78,12.35 12.37,11.76 v12.37,9.73 | R11.1 60.07,4.72 | 60.07,4.72 60.07,4.42 | 59.77,4.42 60.07,4.72 | 60.07,4.72 60.38,4.42
  Bottom 0.254: v12.37,9.73 12.37,9.17 13.21,8.33 16.23,8.33 17.14,7.42 22.5,7.42 24.18,5.74 35.13,5.74 v36.3,4.57
SIM_CLK  (via drill 0.3)
  Top 0.406: D5.4 v68.89,19.44 69.79,19.44 C99.2 69.85,19.43 R72.2
  Bottom 0.406: SIM.3 61.02,14.87 65.56,19.41 68.85,19.41 v68.89,19.44
SIM_DATA  (via drill 0.3)
  Top 0.254: 68.16,16.34 C100.2 | 68.15,17.66 D5.3
  Top 0.406: 68.15,17.66 68.15,18.21 67.82,18.54 63.45,18.54 v63.4,18.49 | 68.16,16.34 D5.3 | R71.2 C100.2
  Bottom 0.406: SIM.7 61.05,16.14 v63.4,18.49
SIM_RST  (via drill 0.3)
  Top 0.406: D5.5 v67.41,20.17 67.41,20.8 C98.2 R73.2
  Bottom 0.406: SIM.2 61.13,17.41 63.88,20.17 v67.41,20.17
SIM_VDD  (via drill 0.3)
  Top 0.254: 63.45,19.96 C65.2
  Top 0.406: D5.6 65.55,19.44 C88.2 C65.2 | 63.45,19.96 v62.36,19.96 | U5.30 59.91,30.11 v59.92,30.1
  Bottom 0.406: 61.67,19.96 v62.36,19.96 62.36,20.65 | SIM.1 58.04,19.96 61.49,19.96 61.67,19.96 | 62.36,20.65 62.36,27.66 v59.92,30.1 | 61.67,19.96 62.36,20.65
STATUS  (via drill 0.3)
  Top 0.254: 34.51,20.09 U5.66
  Top 0.406: 34.51,20.09 v32.94,20.09 | R83.2 26.54,18.59 v26.54,17.3
  Bottom 0.406: v26.54,17.3 30.15,17.3 v32.94,20.09
SWCLK  (via drill 0.25)
  Top 0.254: IC2.45 16.31,4.13 v16.48,3.96
  Bottom 0.254: v16.48,3.96 17.48,3.96 17.91,3.53 CN2.4
SWDIO
  Top 0.254: IC2.46 16.81,5.36 17.45,4.72 17.45,3.89 16.64,3.07 CN2.2
UART_LOG_RX
  Top 0.61: U5.22 60.52,22.11 TP3.P$1
UART_LOG_TX
  Top 0.61: U5.23 61.29,23.11 TP2.P$1
USB_DN
  Top 0.406: U5.28 62.68,28.11 R77.1
USB_DP
  Top 0.406: U5.27 63.2,27.11 R76.1
V4D2
  Top 0.254: C16.2 C13.2 13.66,26.44 C30.2 C14.2 R15.1 | R24.2 R15.1 | Q2.1 14.71,30.29 D11.A 15.42,30.34 R15.1
  Top 0.305: U3.5 9.72,24.29 9.72,23.62 | 9.72,23.62 L2.2 | C16.2 11.96,23.62 9.72,23.62
  pour Top: 11.66,31.45 16.15,31.45 16.15,26.39 16.15,25.1 14.1,23.04 11.3,23.04 10.95,22.68 10.95,18.41 8.36,18.41 7.75,18.41 7.75,25.55 12.98,25.55 13.26,25.83 13.26,29.13 12.9,29.49 11.71,29.49 11.66,29.49
V_BATT
  Top 0.254: U5.55 U5.56 U5.57 32.19,29.11 D14.- 30.73,29.27 D6.C | C92.A 30.76,29.55 D6.C | D6.C C90.2 27.43,29.39 R82.2 | R82.2 C76.2 | C84.2 C75.2 21.39,29.41 | 21.39,29.41 R60.2 | C77.A 27.71,29.72 R82.2 | 21.39,29.41 20.52,29.41 C91.2 19.81,31.67 R12.1 R96.1
  pour Top: 35.56,28.73 19.91,28.73 19.33,29.31 19.33,33.86 21.29,33.86 21.29,32.31 21.62,31.98 32.44,31.98 32.97,31.45 35.48,31.45 35.56,31.45
VBAT+  (via drill 0.3)
  Top 0.254: J4.1 6.27,42.01 | 6.27,42.01 7.32,42.01 | 7.32,42.01 10.6,42.01 R21.1 C22.1 | BAT.2 6.27,42.01 | SW1.COM1 6.71,34.62 7.32,35.23 7.32,42.01
  Bottom 1.016: J2.11 24.91,50 17.12,42.22 13.37,42.22 v13.36,42.2
  pour Top: 3.68,33.91 6.76,33.91 7.95,35.1 7.95,40.97 8.41,41.43 14.61,41.43 14.61,42.95 2.87,42.95 2.87,41.02 6.12,41.02 6.71,40.44 6.71,35.89 6.27,35.46 3.68,35.46
VBAT-  (via drill 0.3)
  Top 0.254: J4.2 6.3,44.91 | 6.3,44.91 8.28,44.91 C25.1 8.81,48.48 R22.1 8.82,48.47 U1.3 | BAT.1 6.27,44.88 6.3,44.91
  Top 0.61: U1.6 12.33,45.15 v12.34,45.14
  Bottom 0.61: v12.34,45.14 12.32,45.16 6.9,45.16 BAT.1
  pour Top: 2.84,43.84 6.88,43.84 7.8,44.75 9.22,44.75 9.55,45.09 9.55,47.47 9.88,47.8 10.64,47.8 10.64,49.05 8.1,49.05 8.1,47.35 6.78,46.02 2.84,46.02
VBAT_ADC
  Top 0.61: U5.51 38.53,41.2 C21.1 R45.2 R44.1
VBAT_IN  (via drill 0.3)
  Top 0.254: D4.A 10.12,35.04 R5.2
  Top 0.61: R44.2 36.25,41.25 35.81,41.68 v35.81,42.47 | v30.73,42.47 24.41,42.47 v22.99,43.89 | SW1.CH1A 10.08,32.08 | v10.48,32.13 10.43,32.08 10.08,32.08 | Q2.3 10.03,32.03 | 10.03,32.03 10.03,33.63 D4.A | 10.08,32.08 10.03,32.03
  Bottom 0.61: v30.73,42.47 v35.81,42.47 | v22.99,43.89 11.23,32.13 v10.48,32.13
  pour Top: 3.81,33.3 7.21,33.3 9.7,35.79 10.9,35.79 10.9,30.78 3.81,30.78
VBUS  (via drill 0.25, 0.3)
  Top 0.254: USB-MCU.VBUS2 5.65,9.41 4.32,10.74 4.32,12.95 v4.29,12.98 5.62,14.31 USB-MCU.VBUS1 | 20.2,42.8 C8.1 20.12,45.56 D2.C
  Top 0.406: v4.29,12.98 4.29,13.01
  Top 0.61: U2.8 19.56,42.24 C8.1 20.12,41.68 CHG.2 | C23.1 14.1,50 v14.1,49.4 U2.4
  Top 0.813: 4.5,9.83 3.83,10.49 v3.83,13.54 4.12,13.82 4.65,13.82
  Top 1.016: D2.C 20.19,45.65 v20.19,48.11
  Bottom 1.016: 3.3,13.97 v4.29,12.98 3.25,14.02 3.25,33.12 3.25,33.3 | 3.25,33.3 3.25,34.62 | 3.25,35.84 3.25,38.1 4.12,38.96 16.28,38.96 v19.23,41.91 | SW1.COM2 3.25,34.62 | v20.19,48.11 18.9,49.4 v14.1,49.4 | 1.7,34.62 2.03,34.62 3.25,35.84 | 3.25,35.84 3.25,34.62 | 3.25,33.3 1.96,34.59
  pour Top: 6.65,9.14 5.16,9.14 3.73,10.57 3.73,13.08 5.33,14.68 6.65,14.68 6.65,14.02 5.71,14.02 4.72,13.03 4.67,12.98 4.67,10.59 5.51,9.75 6.65,9.75
  pour Top: 20.73,41.22 17.63,41.22 17.63,42.93 18.75,42.93 19.25,43.43 19.25,48.62 21.03,48.62 21.03,43.71 20.83,43.51 20.73,43.41
VDD  (via drill 0.3)
  Top 0.406: R93.1 36.5,44.42 34.98,42.9 34.98,39.62 v33.96,38.61 | C95.2 31.01,15.8 | 31.01,15.8 31.01,15.93 | 31.01,15.93 C94.2 | U5.99 32.58,16.11 TP1.P$1 31.95,16.13 | 31.95,16.13 31.22,16.13 31.01,15.93 | 31.95,16.13 31.93,16.15 v31.93,16.71 31.9,16.69 | 31.01,15.8 31.9,16.69 | 31.9,16.69 32.46,16.13 32.59,16.13
  Bottom 0.406: v31.93,16.71 31.93,17.04 33.96,19.07 v33.96,38.61
VDDCORE
  Top 0.254: IC2.43 15.31,7.72 14.81,7.21 14.45,7.21 C7.1
VIN
  Top 0.254: Q2.2 D4.C 15.09,33.73 | R12.2 R96.2 18.26,33.81 | 18.26,33.81 18.26,34.66 U8.3 | 15.09,33.73 18.19,33.73 18.26,33.81 | C17.2 C10.2 16.11,37.02 U8.1 16.16,37.02 15.09,35.94 D11.C 15.09,33.73
  pour Top: 11.56,34.39 12.52,34.39 12.88,34.75 12.88,37.13 12.88,37.29 15.88,37.29 16.28,37.69 18.49,37.69 18.49,36.75 16.94,36.75 16.54,36.35 16.54,35.79 16.94,35.38 18.49,35.38 18.77,35.38 18.77,31.27 17.2,31.27 16.56,31.9 11.71,31.9 11.56,31.9
VSYS
  Top 0.305: U3.2 4.6,26.79 R13.2 4.19,27 2.64,27 | SW1.CH2A 2.64,31.17 2.64,30.02 | 2.64,30.02 C34.2 2.64,27 | 2.64,27 C20.2 C33.2 R10.2 | R14.2 5.59,30.02 2.64,30.02
  pour Top: 0.89,32.72 0.89,30.71 1.98,29.62 1.98,22.71 3.17,22.71 3.38,22.71 3.38,26.14 3.89,26.64 6.5,26.64 6.5,26.92 5.16,26.92 4.52,27.56 3.73,27.56 3.38,27.91 3.38,29.31 3.61,29.54 5.03,29.54 5.94,28.63 6.88,28.63 6.88,29.62 6.25,30.25 3.48,30.25 3.15,30.58 3.15,32.05 2.49,32.72
VUSB  (via drill 0.25, 0.3)
  Top 0.203: 66.73,32.64 66.52,32.84
  Top 0.61: USB-LTE.VBUS2 67.88,31.48 v67.09,32.27 | v67.09,32.27 66.73,32.64 | C66.1 66.52,32.84 v67.09,32.27 | USB-LTE.VBUS1 67.86,26.58 v67.16,25.88 | v67.16,25.88 66.42,25.15 C74.1 | U5.24 65.39,24.11 v67.16,25.88 | v31.62,43.38 25.27,43.38 24.26,44.4 D2.A
  Bottom 0.203: 67.16,32.21 v67.09,32.27
  Bottom 0.61: v67.16,25.88 67.16,32.21 | v31.62,43.38 44.4,43.38 45.34,42.44 56.92,42.44 v67.09,32.27

## Text on the board
tPlace: VBAT | GND | 3V3 | D8 | D7 | D6 | D9 | D5 | D4 | D3 | D2 | VBAT | - | + | OFF | ON | TX | RX | VDD | 1V8 | SWD | RST | D13 | D12 | D11 | D10 | A0 | A1 | A2 | A3 | A4 | A5 | GND | 3V3 | SCL | SDA
bPlace: VBAT | D8 | D7 | D6 | GND | 3V3 | D9 | D5 | D4 | D3 | D2 | - | + | Maduino Zero 4G | OFF | LTE CAT1 A7670X V1.1 | ON | www.makerfabs.com | RST | D13 | D12 | D11 | D10 | A0 | A1 | A2 | A3 | A4 | A5 | GND | 3V3 | SCL | SDA